# Altium schematic sheet [01] - PWR.SchDoc
size A
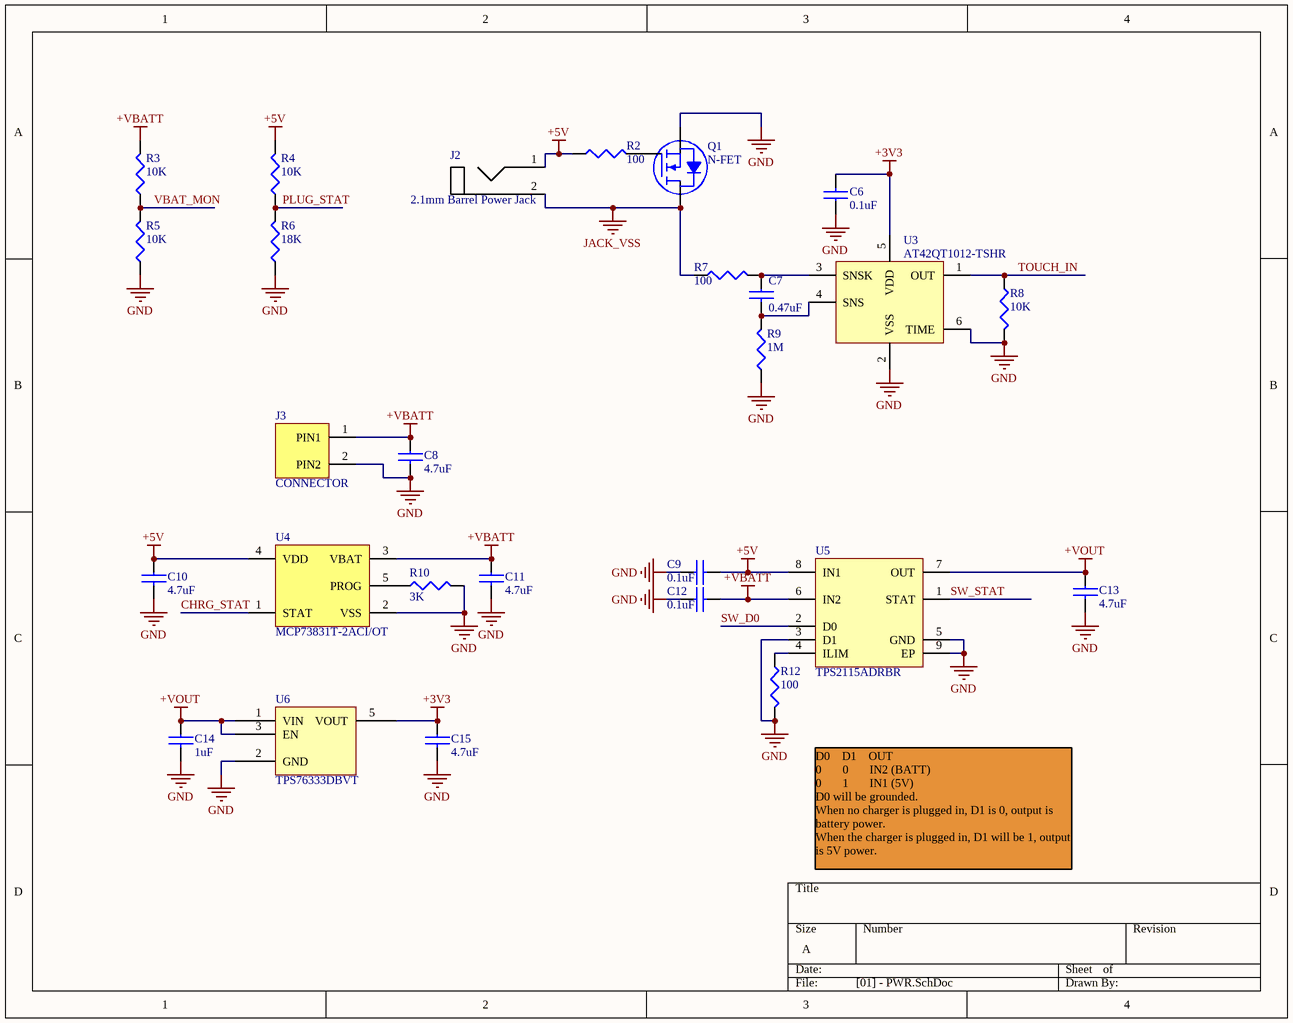
[diagram p0: [01] - PWR.SchDoc]

## Parts
C6  0.1uF  [C0402]
C7  0.47uF  [C0402]
C8  4.7uF  [C0603]
C9  0.1uF  [C0402]
C10  4.7uF  [C0603]
C11  4.7uF  [C0603]
C12  0.1uF  [C0402]
C13  4.7uF  [C0603]
C14  1uF  [C0402]
C15  4.7uF  [C0603]
J2  2.1mm Barrel Power Jack  [2.1mm Power Jack]
J3  CONNECTOR  [S2B-PH-K-S]
Q1  N-FET  [SOT-23-3]
R2  100  [R0402]
R3  10K  [R0402]
R4  10K  [R0402]
R5  10K  [R0402]
R6  18K  [R0402]
R7  100  [R0402]
R8  10K  [R0402]
R9  1M  [R0402]
R10  3K  [R0402]
R12  100  [R0402]
U3  AT42QT1012-TSHR  [SOT-23-6]
U4  MCP73831T-2ACI/OT  [SOT-23-5]
U5  TPS2115ADRBR  [VSON-8]
U6  TPS76333DBVT  [SOT-23-5]

## Nets
+3V3: C6.2 C15.1 U3.5(VDD) U6.5(VOUT)
+5V: C9.2 C10.1 J2.1(+) R2.1 R4.2 U4.4(VDD) U5.8(IN1)
+VBATT: C8.1 C11.1 C12.2 J3.1(PIN1) R3.2 U4.3(VBAT) U5.6(IN2)
+VOUT: C13.1 C14.1 U5.7(OUT) U6.1(VIN) U6.3(EN)
GND: C6.1 C8.2 C9.1 C10.2 C11.2 C12.1 C13.2 C14.2 C15.2 J3.2(PIN2) Q1.2(S) R5.1 R6.1 R8.2 R9.1 R10.2 R12.2 U3.2(VSS) U3.6(TIME) U4.2(VSS) U5.3(D1) U5.5(GND) U5.9(EP) U6.2(GND)
JACK_VSS: J2.2(+) Q1.3(D) R7.1
CHRG_STAT: U4.1(STAT)
PLUG_STAT: R4.1 R6.2
SW_D0: U5.2(D0)
SW_STAT: U5.1(STAT)
TOUCH_IN: R8.1 U3.1(OUT)
VBAT_MON: R3.1 R5.2
NetC7_1: C7.1 R7.2 U3.3(SNSK)
NetC7_2: C7.2 R9.2 U3.4(SNS)
NetQ1_1: Q1.1(G) R2.2
NetR10_1: R10.1 U4.5(PROG)
NetR12_1: R12.1 U5.4(ILIM)

## Notes on the sheet
- D0    D1    OUT
  0       0       IN2 (BATT)
  0       1       IN1 (5V)
  D0 will be grounded.
  When no charger is plugged in, D1 is 0, output is battery power.
  When the charger is plugged in, D1 will be 1, output is 5V power.

## Library data of the parts
C6 C9 C12 = CL05B104KO5NNNC: Cap Ceramic 0.1uF 16V X7R 10% SMD 0402 125C C/T; Manufacturer 1: Samsung; Description 1: Cap Ceramic 0.1uF 16V X7R 10% SMD 0402 125C Paper T/R; Capacitance: 100nF; Supplier 1: Digi-Key; Supplier Part Number 1: 1276-1001-6-ND; Manufacturer Part Number 1: CL05B104KO5NNNC; Stock 1: 9531; Pricing 1: 1=0.1, 10=0.018, 100=0.0081, 500=0.0058, 1000=0.0045, 2500=0.0041, 5000=0.0038 (USD); Mount: Surface Mount; Case/Package: 0402; Case Code (Metric): 1005; Case Code (Imperial): 0402; Material: Ceramic; Contact Plating: Tin; Min Operating Temperature: -55°C; Max Operating Temperature: 125°C; Tolerance: 10%; Package Quantity: 1; Packaging: Tape and Reel; Voltage Rating: 16V; Dielectric: X7R; Voltage: 16V; Voltage Rating (DC): 16V; Length: 1mm; Height: 0.5mm; Width: 0.02inch; Thickness: 0.022inch; Depth: 0.5mm; Radiation Hardening: No; Lead Free: Lead Free; ComponentLink1URL: https://datasheet.ciiva.com/16208/cl05b104kq5nnnc-16208343.pdf; ComponentLink1Description: https://datasheet.ciiva.com/16208/cl05b104kq5nnnc-16208343.pdf; ComponentLink2URL: https://datasheet.ciiva.com/26920/getdatasheetpartid-359683-26920169.pdf; ComponentLink2Description: https://datasheet.ciiva.com/26920/getdatasheetpartid-359683-26920169.pdf; ComponentLink3URL: https://datasheet.ciiva.com/26309/mlcc-catalogdownload2013-eng-26309003.pdf; ComponentLink3Description: https://datasheet.ciiva.com/26309/mlcc-catalogdownload2013-eng-26309003.pdf; ComponentLink4URL: https://datasheet.ciiva.com/29198/458718-da-01-en-vs-kondensator-0402-29198423.pdf; ComponentLink4Description: https://datasheet.ciiva.com/29198/458718-da-01-en-vs-kondensator-0402-29198423.pdf
C7 = CL05A474KP5NNNC: Cap Ceramic 0.47uF 10V X5R 10% SMD 0402 85C T/R; Manufacturer: Samsung; Capacitance: 470nF; Supplier 1: Digi-Key; Supplier Part Number 1: 1276-1173-1-ND; Manufacturer Part Number: CL05A474KP5NNNC; RoHS: Yes; Category: Ceramic Capacitors; Stock 1: 1647717; Pricing 1: 1=0.10000, 10=0.06000, 50=0.03260, 100=0.02670, 500=0.01906, 1000=0.01497, 2500=0.01361, 5000=0.01252 (USD); Mount: Surface Mount; Case/Package: 0402; Case Code (Metric): 1005; Case Code (Imperial): 0402; Min Operating Temperature: -55°C; Max Operating Temperature: 85°C; Tolerance: 10%; Dielectric: X5R; Packaging: Tape and Reel; Voltage Rating: 10V; Voltage Rating (DC): 10V; Series: CL; Construction: Flat; Length: 1mm; Width: 0.02inch; Height: 0.5mm; Thickness: 0.022inch; Depth: 0.5mm; Radiation Hardening: No; Lead Free: Lead Free; RoHS Compliant: Yes; ComponentLink1URL: https://datasheet.ciiva.com/25710/cl05a474kp5nnnc-25710324.pdf?src-supplier=Digi-Key; ComponentLink1Description: https://datasheet.ciiva.com/25710/cl05a474kp5nnnc-25710324.pdf?src-supplier=Digi-Key; ComponentLink2URL: https://datasheet.ciiva.com/26838/getdatasheetpartid-355286-26838191.pdf?src-supplier=Verical; ComponentLink2Description: https://datasheet.ciiva.com/26838/getdatasheetpartid-355286-26838191.pdf?src-supplier=Verical; ComponentLink3URL: https://datasheet.ciiva.com/16437/cl05b104kq5nnnc-16437351.pdf?src-supplier=Future+Electronics; ComponentLink3Description: https://datasheet.ciiva.com/16437/cl05b104kq5nnnc-16437351.pdf?src-supplier=Future+Electronics
C8 C10 C11 C13 C15 = CC0603KRX5R6BB475: 4.7µF ±10% 10V X5R Ceramic Capacitor -55°C ~ 85°C Surface Mount, MLCC 0603 (1608 Metric) 0.063" L x 0.031" W (1.60mm x 0.80mm); Manufacturer 1: Yageo; Supplier 1: Digi-Key; Supplier Part Number 1: 311-1455-6-ND; Manufacturer Part Number 1: CC0603KRX5R6BB475; Description 1: 4.7µF ±10% 10V X5R Ceramic Capacitor -55°C ~ 85°C Surface Mount, MLCC 0603 (1608 Metric) 0.063" L x 0.031" W (1.60mm x 0.80mm); Stock 1: 166715; Pricing 1: 1=0.16, 10=0.115, 100=0.0543, 500=0.0381, 1000=0.0315 (USD); Mount: Surface Mount; Case/Package: 0603; Case Code (Imperial): 0603; Case Code (Metric): 1608; Min Operating Temperature: -55°C; Max Operating Temperature: 85°C; Capacitance: 4.7uF; Voltage Rating: 10V; Voltage Rating (DC): 10V; Tolerance: 10%; Packaging: Tape and Reel; Package Quantity: 1; Dielectric: X5R; Termination: SMD/SMT; Composition: Ceramic; Length: 1.6mm; Height: 0.8mm; Width: 0.8mm; Thickness: 0.035inch; Depth: 0.8mm; Radiation Hardening: No; REACH SVHC: Unknown; Lead Free: Lead Free; Halogen Free: Halogen Free; ComponentLink1URL: https://datasheet.ciiva.com/8033/1525783-8033798.pdf; ComponentLink1Description: https://datasheet.ciiva.com/8033/1525783-8033798.pdf; ComponentLink2URL: https://datasheet.ciiva.com/179/mlccorderingcode-179704.pdf; ComponentLink2Description: https://datasheet.ciiva.com/179/mlccorderingcode-179704.pdf; ComponentLink3URL: https://datasheet.ciiva.com/179/mlccorderingcode-179705.pdf; ComponentLink3Description: https://datasheet.ciiva.com/179/mlccorderingcode-179705.pdf; ComponentLink4URL: https://datasheet.ciiva.com/179/mlccorderingcode-179706.pdf; ComponentLink4Description: https://datasheet.ciiva.com/179/mlccorderingcode-179706.pdf; ComponentLink5URL: https://datasheet.ciiva.com/8033/1525783-8033802.pdf; ComponentLink5Description: https://datasheet.ciiva.com/8033/1525783-8033802.pdf; ComponentLink6URL: https://datasheet.ciiva.com/11586/upy-gphc-x5r-4v-to-50v-12-11586314.pdf; ComponentLink6Description: https://datasheet.ciiva.com/11586/upy-gphc-x5r-4v-to-50v-12-11586314.pdf; ComponentLink7URL: https://datasheet.ciiva.com/16623/upy-gphc-x5r-4v-to-50v-12-16623983.pdf; ComponentLink7Description: https://datasheet.ciiva.com/16623/upy-gphc-x5r-4v-to-50v-12-16623983.pdf
C14 = CL05A105MP5NNNC: Cap Ceramic 1uF 10V X5R 20% SMD 0402 85C C/T; Manufacturer 1: Samsung; Description 1: Cap Ceramic 1uF 10V X5R 20% SMD 0402 85C Paper T/R; Supplier 1: Digi-Key; Supplier Part Number 1: 1276-1448-6-ND; Manufacturer Part Number 1: CL05A105MP5NNNC; Stock 1: 42775; Pricing 1: 1=0.1, 10=0.028, 100=0.0124, 500=0.0089, 1000=0.007, 2500=0.0063, 5000=0.0058 (USD); Mount: Surface Mount; Case/Package: 0402; Case Code (Metric): 1005; Case Code (Imperial): 0402; Min Operating Temperature: -55°C; Max Operating Temperature: 85°C; Package Quantity: 1; Packaging: Tape and Reel; Capacitance: 1uF; Tolerance: 20%; Voltage Rating: 10V; Dielectric: X5R; Voltage Rating (DC): 10V; Length: 1mm; Height: 0.5mm; Width: 0.02inch; Thickness: 0.022inch; Depth: 0.5mm; Radiation Hardening: No; Lead Free: Lead Free; ComponentLink1URL: https://datasheet.ciiva.com/25802/cl05a105mp5nnnc-25802049.pdf; ComponentLink1Description: https://datasheet.ciiva.com/25802/cl05a105mp5nnnc-25802049.pdf
J2 = 2.1mm Barrel Power Jack: 2.1mm Barrel Power Jack Panel Mount
J3 = S2B-PH-K-S(LF)(SN): CONN HEADER R/A 2POS 2MM; Manufacturer 1: JST; Current Rating: 2A; Contact Resistance: 20mR; Voltage Rating: 100V; Number of Positions: 2; Gender: Male; Connector Type: Male Pin; Insulation Resistance: 1GR; Supplier 1: Digi-Key; Supplier Part Number 1: 455-1719-ND; Manufacturer Part Number 1: S2B-PH-K-S(LF)(SN); Stock 1: 161668; Pricing 1: 1=0.17, 10=0.161, 100=0.0991, 500=0.08202, 1000=0.07177, 5000=0.06152, 10000=0.05981 (USD); Mount: Through Hole; Number of Pins: 2; Contact Material: Tin,Brass,Bronze; Contact Plating: Tin,Copper; Color: Natural,White; Housing Color: White; Housing Material: Polyamide; Min Operating Temperature: -25°C; Max Operating Temperature: 85°C; Max Current Rating: 2A; Number of Rows: 1; Packaging: Bulk; Termination: Solder; Fastening Type: Detent; Number of Contacts: 2; Max Voltage Rating (AC): 100V; Orientation: Right Angle; Number of Poles: 2; Voltage Rating (AC): 100V; Max Voltage Rating (DC): 100V; Working Voltage: 100V; Length: 5.9mm; Height: 9.4mm; Pitch: 2mm; Width: 4.5mm; Contact Mating Length: 0.13inch; Depth: 7.6mm; Lead Pitch: 2mm; REACH SVHC: No SVHC; Lead Free: Lead Free; Flammability Rating: UL94 V-0; ComponentLink1URL: http://www1.futureelectronics.com/doc/JST/S2B-PH-K-S(LF)(SN).pdf?src-supplier=Future+Electronics; ComponentLink1Description: http://www1.futureelectronics.com/doc/JST/S2B-PH-K-S(LF)(SN).pdf?src-supplier=Future+Electronics; ComponentLink2URL: https://www.verical.com/server-webapp/html/getDatasheet?partID=641020&src-supplier=Verical; ComponentLink2Description: https://www.verical.com/server-webapp/html/getDatasheet?partID=641020&src-supplier=Verical; ComponentLink3URL: http://www.jst-mfg.com/product/pdf/eng/ePH.pdf?src-supplier=Digi-Key; ComponentLink3Description: http://www.jst-mfg.com/product/pdf/eng/ePH.pdf?src-supplier=Digi-Key; ComponentLink4URL: http://www.farnell.com/datasheets/80564.pdf?src-supplier=Element14; ComponentLink4Description: http://www.farnell.com/datasheets/80564.pdf?src-supplier=Element14
Q1 = NDS331N: MOSFET N-CH 20V 1.3A SSOT3; Manufacturer 1: ON Semiconductor / Fairchild; Nominal Vgs: 700mV; Rds On Max: 160mR; Input Capacitance: 162pF; Rise Time: 25ns; Max Power Dissipation: 500mW; Number of Elements: 1; Gate to Source Voltage (Vgs): 8V; Fall Time: 5ns; Drain to Source Resistance: 210mR; Turn-Off Delay Time: 10ns; Element Configuration: Single; Supplier 1: Digi-Key; Supplier Part Number 1: NDS331NCT-ND; Manufacturer Part Number 1: NDS331N; Stock 1: 114658; Pricing 1: 1=0.44, 10=0.349, 100=0.2395, 500=0.16424, 1000=0.12318 (USD); Mount: Surface Mount; Case/Package: TO-236-3; Number of Pins: 3; Weight: 0.03g; Min Operating Temperature: -55°C; Max Operating Temperature: 150°C; Package Quantity: 1; Packaging: Tape and Reel; Drain to Source Voltage (Vdss): 20V; Continuous Drain Current (ID): 1.3A; Drain to Source Breakdown Voltage: 20V; Power Dissipation: 500mW; Threshold Voltage: 700mV; Turn-On Delay Time: 5ns; Voltage Rating (DC): 20V; Current Rating: 1.3A; On-State Resistance: 160mR; Length: 2.92mm; Height: 0.94mm; Width: 1.4mm; Radiation Hardening: No; REACH SVHC: No SVHC; Lead Free: Lead Free; ComponentLink1URL: http://www.farnell.com/datasheets/2303897.pdf?src-supplier=Newark; ComponentLink1Description: http://www.farnell.com/datasheets/2303897.pdf?src-supplier=Newark; ComponentLink2URL: http://www.farnell.com/datasheets/195775.pdf?src-supplier=Element14; ComponentLink2Description: http://www.farnell.com/datasheets/195775.pdf?src-supplier=Element14; ComponentLink3URL: https://www.verical.com/server-webapp/html/getDatasheet?partID=110520&src-supplier=Verical; ComponentLink3Description: https://www.verical.com/server-webapp/html/getDatasheet?partID=110520&src-supplier=Verical; ComponentLink4URL: http://www.jameco.com/Jameco/Products/ProdDS/1030703.pdf?src-supplier=Jameco; ComponentLink4Description: http://www.jameco.com/Jameco/Products/ProdDS/1030703.pdf?src-supplier=Jameco; ComponentLink5URL: http://www.mouser.com/ds/2/149/NDS331N-116501.pdf?src-supplier=Mouser; ComponentLink5Description: http://www.mouser.com/ds/2/149/NDS331N-116501.pdf?src-supplier=Mouser; ComponentLink6URL: https://www.fairchildsemi.com/datasheets/ND/NDS331N.pdf?src-supplier=Avnet; ComponentLink6Description: https://www.fairchildsemi.com/datasheets/ND/NDS331N.pdf?src-supplier=Avnet; ComponentLink7URL: http://www.fairchildsemi.com/ds/ND/NDS331N.pdf?src-supplier=Avnet+Europe; ComponentLink7Description: http://www.fairchildsemi.com/ds/ND/NDS331N.pdf?src-supplier=Avnet+Europe
R2 R7 R12 = ERJ-2GEJ101X: Res Thick Film 0402 100 Ohm 5% 0.1W(1/10W) ±200ppm/C Molded SMD Automotive T/R; Manufacturer 1: Panasonic ECG; Resistance: 100R; Temperature Coefficient: 200ppm/°C; Power Rating: 100mW; Voltage Rating: 50V; Supplier 1: Digi-Key; Supplier Part Number 1: P100JDKR-ND; Manufacturer Part Number 1: ERJ-2GEJ101X; Description 1: Res Thick Film 0402 100 Ohm 5% 0.1W(1/10W) ±200ppm/C Molded SMD Automotive T/R; Stock 1: 1981514; Pricing 1: 1=0.1, 10=0.029, 100=0.0117, 1000=0.0053, 2500=0.0046, 5000=0.0038 (USD); Mount: Surface Mount; Case/Package: 0402; Contact Plating: Tin; Case Code (Imperial): 0402; Case Code (Metric): 1005; Min Operating Temperature: -55°C; Max Operating Temperature: 155°C; Tolerance: 5%; Composition: Thick Film; Packaging: Cut Tape; Package Quantity: 1; Termination: SMD/SMT; Number of Terminations: 2; Military Standard: Not; Max Power Dissipation: 100mW; Voltage Rating (DC): 50V; Length: 1mm; Height: 0.35mm; Depth: 0.5mm; Width: 0.5mm; Radiation Hardening: No; REACH SVHC: No SVHC; Lead Free: Lead Free; ComponentLink1URL: https://datasheet.ciiva.com/11821/0900766b80f806dd-11821172.pdf; ComponentLink1Description: https://datasheet.ciiva.com/11821/0900766b80f806dd-11821172.pdf; ComponentLink2URL: https://datasheet.ciiva.com/16767/70260739-16767557.pdf; ComponentLink2Description: https://datasheet.ciiva.com/16767/70260739-16767557.pdf; ComponentLink3URL: https://datasheet.ciiva.com/48531/aoa0000ce1-48531079.pdf; ComponentLink3Description: https://datasheet.ciiva.com/48531/aoa0000ce1-48531079.pdf; ComponentLink4URL: https://datasheet.ciiva.com/16511/aoa0000ce1-16511417.pdf; ComponentLink4Description: https://datasheet.ciiva.com/16511/aoa0000ce1-16511417.pdf; ComponentLink5URL: https://datasheet.ciiva.com/16777/70260739-16777609.pdf; ComponentLink5Description: https://datasheet.ciiva.com/16777/70260739-16777609.pdf; ComponentLink6URL: https://datasheet.ciiva.com/9186/aoa0000ce1-9186682.pdf; ComponentLink6Description: https://datasheet.ciiva.com/9186/aoa0000ce1-9186682.pdf; ComponentLink7URL: https://datasheet.ciiva.com/17207/aoa0000ce1-17207978.pdf; ComponentLink7Description: https://datasheet.ciiva.com/17207/aoa0000ce1-17207978.pdf; ComponentLink8URL: https://datasheet.ciiva.com/30133/4aoa0000ce1-30133884.pdf; ComponentLink8Description: https://datasheet.ciiva.com/30133/4aoa0000ce1-30133884.pdf; ComponentLink9URL: https://datasheet.ciiva.com/46389/1500035-46389644.pdf; ComponentLink9Description: https://datasheet.ciiva.com/46389/1500035-46389644.pdf; ComponentLink10URL: https://datasheet.ciiva.com/43460/1500035-43460365.pdf; ComponentLink10Description: https://datasheet.ciiva.com/43460/1500035-43460365.pdf
R3-R5 R8 = ERJ-2GEJ103X: Res Thick Film 0402 10K Ohm 5% 0.1W(1/10W) ±200ppm/C Molded SMD Automotive Punched T/R; Manufacturer 1: Panasonic ECG; Resistance: 10kR; Temperature Coefficient: 200ppm/°C; Power Rating: 100mW; Voltage Rating: 50V; Supplier 1: Digi-Key; Supplier Part Number 1: P10KJDKR-ND; Manufacturer Part Number 1: ERJ-2GEJ103X; Description 1: Res Thick Film 0402 10K Ohm 5% 0.1W(1/10W) ±200ppm/C Molded SMD Automotive Punched T/R; Stock 1: 1210425; Pricing 1: 1=0.1, 10=0.029, 100=0.0117, 1000=0.0053, 2500=0.0046, 5000=0.0038 (USD); Mount: Surface Mount; Case/Package: 0402; Contact Plating: Tin; Case Code (Metric): 1005; Case Code (Imperial): 0402; Min Operating Temperature: -55°C; Max Operating Temperature: 155°C; Tolerance: 5%; Packaging: Cut Tape; Composition: Thick Film; Package Quantity: 1; Number of Terminations: 2; Termination: SMD/SMT; Military Standard: Not; Max Power Dissipation: 100mW; Voltage Rating (DC): 50V; Length: 1mm; Height: 0.35mm; Depth: 0.5mm; Width: 0.02inch; Radiation Hardening: No; REACH SVHC: No SVHC; Lead Free: Lead Free; ComponentLink1URL: https://datasheet.ciiva.com/11821/0900766b80f806dd-11821170.pdf; ComponentLink1Description: https://datasheet.ciiva.com/11821/0900766b80f806dd-11821170.pdf; ComponentLink2URL: https://datasheet.ciiva.com/17212/aoa0000ce1-17212101.pdf; ComponentLink2Description: https://datasheet.ciiva.com/17212/aoa0000ce1-17212101.pdf; ComponentLink3URL: https://datasheet.ciiva.com/46371/1678796-46371910.pdf; ComponentLink3Description: https://datasheet.ciiva.com/46371/1678796-46371910.pdf; ComponentLink4URL: https://datasheet.ciiva.com/24070/aoa0000ce1-37422-24070679.pdf; ComponentLink4Description: https://datasheet.ciiva.com/24070/aoa0000ce1-37422-24070679.pdf; ComponentLink5URL: https://datasheet.ciiva.com/43460/1678796-43460391.pdf; ComponentLink5Description: https://datasheet.ciiva.com/43460/1678796-43460391.pdf; ComponentLink6URL: https://datasheet.ciiva.com/16774/70260739-16774504.pdf; ComponentLink6Description: https://datasheet.ciiva.com/16774/70260739-16774504.pdf; ComponentLink7URL: https://datasheet.ciiva.com/27055/1935721-27055112.pdf; ComponentLink7Description: https://datasheet.ciiva.com/27055/1935721-27055112.pdf; ComponentLink8URL: https://datasheet.ciiva.com/16767/70260739-16767130.pdf; ComponentLink8Description: https://datasheet.ciiva.com/16767/70260739-16767130.pdf; ComponentLink9URL: https://datasheet.ciiva.com/28514/1678796-28514154.pdf; ComponentLink9Description: https://datasheet.ciiva.com/28514/1678796-28514154.pdf; ComponentLink10URL: https://datasheet.ciiva.com/48531/aoa0000ce1-48531082.pdf; ComponentLink10Description: https://datasheet.ciiva.com/48531/aoa0000ce1-48531082.pdf; ComponentLink11URL: https://datasheet.ciiva.com/9194/aoa0000ce1-9194140.pdf; ComponentLink11Description: https://datasheet.ciiva.com/9194/aoa0000ce1-9194140.pdf; ComponentLink12URL: https://datasheet.ciiva.com/22785/1678796-22785949.pdf; ComponentLink12Description: https://datasheet.ciiva.com/22785/1678796-22785949.pdf
R6 = RC0402FR-0718KL: RES SMD 18K OHM 1% 1/16W 0402; Manufacturer: Yageo; Resistance: 18kR; Power Rating: 63mW; Voltage Rating: 50V; Temperature Coefficient: 100ppm/°C; Supplier 1: Digi-Key; Supplier Part Number 1: 311-18.0KLRCT-ND; Manufacturer Part Number: RC0402FR-0718KL; RoHS: Yes; Category: Chip SMD Resistors; Stock 1: 341841; Pricing 1: 1=0.10000, 10=0.01400, 100=0.00580, 1000=0.00260, 2500=0.00226, 5000=0.00186 (USD); Case/Package: 0402; Case Code (Metric): 1005; Case Code (Imperial): 0402; Size Code: 0402; Min Operating Temperature: -55°C; Max Operating Temperature: 155°C; Tolerance: 1%; Packaging: Tape and Reel; Package Quantity: 1; Resistor Type: Thick Film; Number of Terminations: 2; Termination: SMD/SMT; Max Power Dissipation: 63mW; Features: Moisture Resistant; Series: RC; Construction: Rectangular; Technology: THICK FILM; Resistance Tolerance: 1%; Length: 1mm; Width: 0.02inch; Height: 0.016inch; Depth: 0.5mm; REACH SVHC: Unknown; Military Standard: Not; Lead Free: Lead Free; RoHS Compliant: Yes; ComponentLink1URL: https://datasheet.ciiva.com/11808/0900766b80c66297-11808760.pdf?src-supplier=RSComponents; ComponentLink1Description: https://datasheet.ciiva.com/11808/0900766b80c66297-11808760.pdf?src-supplier=RSComponents; ComponentLink2URL: https://datasheet.ciiva.com/2453/pyu-r-int-thick-7-2453604.pdf?src-supplier=Digi-Key; ComponentLink2Description: https://datasheet.ciiva.com/2453/pyu-r-int-thick-7-2453604.pdf?src-supplier=Digi-Key; ComponentLink3URL: https://datasheet.ciiva.com/2453/pyu-r-int-thick-7-2453605.pdf?src-supplier=Digi-Key; ComponentLink3Description: https://datasheet.ciiva.com/2453/pyu-r-int-thick-7-2453605.pdf?src-supplier=Digi-Key; ComponentLink4URL: https://datasheet.ciiva.com/2453/pyu-r-int-thick-7-2453606.pdf?src-supplier=Digi-Key; ComponentLink4Description: https://datasheet.ciiva.com/2453/pyu-r-int-thick-7-2453606.pdf?src-supplier=Digi-Key; ComponentLink5URL: https://datasheet.ciiva.com/16741/pyu-rc0402-51-rohs-l-6-r-16741882.pdf?src-supplier=Future+Electronics; ComponentLink5Description: https://datasheet.ciiva.com/16741/pyu-rc0402-51-rohs-l-6-r-16741882.pdf?src-supplier=Future+Electronics; ComponentLink6URL: https://datasheet.ciiva.com/5558/pyu-rc0402-51-rohs-l-6-r-8721-5558222.pdf?src-supplier=Mouser; ComponentLink6Description: https://datasheet.ciiva.com/5558/pyu-rc0402-51-rohs-l-6-r-8721-5558222.pdf?src-supplier=Mouser; ComponentLink7URL: https://datasheet.ciiva.com/7849/1018594-7849855.pdf?src-supplier=Element14; ComponentLink7Description: https://datasheet.ciiva.com/7849/1018594-7849855.pdf?src-supplier=Element14
R9 = RC0402JR-071ML: Manufacturer 1: Yageo; Resistance: 1MR; Power Rating: 62.5mW; Tolerance: 5%; Voltage Rating: 50V; Temperature Coefficient: 100ppm/°C; Max Power Dissipation: 63mW; Supplier 1: Digi-Key; Supplier Part Number 1: 311-1.0MJRCT-ND; Manufacturer Part Number 1: RC0402JR-071ML; Stock 1: 2904136; Pricing 1: 1=0.1, 10=0.013, 100=0.0055, 1000=0.00245, 2500=0.00212, 5000=0.00176 (USD); Case/Package: 0402; Weight: 2.3E-05oz; Case Code (Metric): 1005; Case Code (Imperial): 0402; Min Operating Temperature: -55°C; Max Operating Temperature: 155°C; Composition: Thick Film; Package Quantity: 1; Packaging: Tape and Reel; Number of Terminations: 2; Termination: SMD/SMT; Military Standard: Not; Features: Moisture Resistant; Length: 1mm; Height: 0.016inch; Width: 0.02inch; Depth: 0.5mm; REACH SVHC: No SVHC; Lead Free: Lead Free; ComponentLink1URL: http://www.yageo.com/documents/recent/PYu-RC_Group_51_RoHS_L_10.pdf?src-supplier=Digi-Key; ComponentLink1Description: http://www.yageo.com/documents/recent/PYu-RC_Group_51_RoHS_L_10.pdf?src-supplier=Digi-Key; ComponentLink2URL: http://www.farnell.com/datasheets/1018594.pdf?src-supplier=Element14; ComponentLink2Description: http://www.farnell.com/datasheets/1018594.pdf?src-supplier=Element14; ComponentLink3URL: http://www.yageo.com/documents/recent/PYu-RC_Group_51_RoHS_L_9.pdf?src-supplier=Mouser; ComponentLink3Description: http://www.yageo.com/documents/recent/PYu-RC_Group_51_RoHS_L_9.pdf?src-supplier=Mouser; ComponentLink4URL: http://www.yageo.com/documents/recent/PYu-RC0402_51_RoHS_L_6_r.pdf?src-supplier=Future+Electronics; ComponentLink4Description: http://www.yageo.com/documents/recent/PYu-RC0402_51_RoHS_L_6_r.pdf?src-supplier=Future+Electronics
R10 = ERJ-2RKF3001X: RES SMD 3K OHM 1% 1/10W 0402; Manufacturer: Panasonic; Power Rating: 100mW; Voltage Rating: 50V; Resistance: 3kR; Temperature Coefficient: 100ppm/°C; Supplier 1: Digi-Key; Supplier Part Number 1: P3.00KLCT-ND; Manufacturer Part Number: ERJ-2RKF3001X; Stock 1: 567304; Pricing 1: 1=0.1, 10=0.045, 100=0.0183, 1000=0.00823, 2500=0.00715, 5000=0.0059 (USD); Mount: Surface Mount; Case/Package: 0402; Case Code (Metric): 1005; Case Code (Imperial): 0402; Contact Plating: Tin; Min Operating Temperature: -55°C; Max Operating Temperature: 155°C; Tolerance: 1%; Packaging: Tape and Reel; Package Quantity: 1; Composition: Thick Film; Number of Terminations: 2; Termination: SMD/SMT; Military Standard: Not; Max Power Dissipation: 100mW; Voltage Rating (DC): 50V; Features: Automotive AEC-Q200; Length: 1mm; Height: 0.35mm; Width: 0.02inch; Depth: 0.5mm; Radiation Hardening: No; REACH SVHC: No SVHC; Lead Free: Lead Free; ComponentLink1URL: http://industrial.panasonic.com/www-data/pdf/AOA0000/AOA0000CE2.pdf?src-supplier=Avnet; ComponentLink1Description: http://industrial.panasonic.com/www-data/pdf/AOA0000/AOA0000CE2.pdf?src-supplier=Avnet; ComponentLink2URL: http://www.farnell.com/datasheets/1694929.pdf?src-supplier=Element14; ComponentLink2Description: http://www.farnell.com/datasheets/1694929.pdf?src-supplier=Element14; ComponentLink3URL: http://www.mouser.com/ds/2/315/AOA0000C283-1093288.pdf?src-supplier=Mouser; ComponentLink3Description: http://www.mouser.com/ds/2/315/AOA0000C283-1093288.pdf?src-supplier=Mouser; ComponentLink4URL: http://www.farnell.com/datasheets/1911175.pdf?src-supplier=Farnell; ComponentLink4Description: http://www.farnell.com/datasheets/1911175.pdf?src-supplier=Farnell; ComponentLink5URL: http://www.farnell.com/datasheets/1678782.pdf?src-supplier=Element14; ComponentLink5Description: http://www.farnell.com/datasheets/1678782.pdf?src-supplier=Element14
U3 = AT42QT1012-TSHR: ATMEL         AT42QT1012-TSHR             Capacitive Touch Sensor, One-Channel, 1.8 V, 5.5 V, SOT-23, 6 Pins, -40 C; Manufacturer: Microchip / Atmel; Resolution: 14b; Operating Supply Current: 59uA; Interface: Serial; Number of Inputs: 1; Nominal Supply Current: 124uA; Min Supply Voltage: 1.8V; Max Supply Voltage: 5.5V; Load Capacitance: 20pF; Supplier 1: Digi-Key; Supplier Part Number 1: AT42QT1012-TSHRCT-ND; Manufacturer Part Number: AT42QT1012-TSHR; Stock 1: 16177; Pricing 1: 1=0.6, 25=0.546, 100=0.4944 (USD); Mount: Surface Mount; Case/Package: SOT-23-6; Number of Pins: 6; Contact Plating: Gold; Min Operating Temperature: -40°C; Max Operating Temperature: 85°C; Packaging: Tape and Reel; Package Quantity: 4500; Number of Channels: 1; Touchscreen: Capacitive; Sensing Method: Capacitive; Length: 3mm; Height: 1.3mm; Width: 1.75mm; REACH SVHC: No SVHC; Lead Free: Lead Free; ComponentLink1URL: http://www.farnell.com/datasheets/1738894.pdf?src-supplier=Element14; ComponentLink1Description: http://www.farnell.com/datasheets/1738894.pdf?src-supplier=Element14; ComponentLink2URL: https://media.digikey.com/pdf/Data%20Sheets/Atmel%20PDFs/Application%20Specific%20Qtouch%20Solutions.pdf?src-supplier=Digi-Key; ComponentLink2Description: https://media.digikey.com/pdf/Data%20Sheets/Atmel%20PDFs/Application%20Specific%20Qtouch%20Solutions.pdf?src-supplier=Digi-Key; ComponentLink3URL: https://www.verical.com/server-webapp/html/getDatasheet?partID=503663&src-supplier=Verical; ComponentLink3Description: https://www.verical.com/server-webapp/html/getDatasheet?partID=503663&src-supplier=Verical
U4 = MCP73831T-2ACI/OT: Manufacturer 1: Microchip; Number of Cells: 1; Output Voltage: 4.2V; Max Supply Voltage: 6V; Min Supply Voltage: 3.75V; Output Current: 500mA; Max Output Voltage: 4.5V; Min Output Voltage: 4.168V; Max Power Dissipation: 1.54W; Drain to Source Resistance: 350mR; Voltage Rating: 4.534V; Supplier 1: Digi-Key; Supplier Part Number 1: MCP73831T-2ACI/OTCT-ND; Manufacturer Part Number 1: MCP73831T-2ACI/OT; Stock 1: 48482; Pricing 1: 1=0.58, 25=0.484, 100=0.4326 (USD); Mount: Surface Mount; Case/Package: SOT-23; Number of Pins: 5; Weight: 0.00709oz; Contact Plating: Tin,Matte; Min Operating Temperature: -40°C; Max Operating Temperature: 85°C; Packaging: Tape and Reel; Max Charge Current: 500mA; Max Input Voltage: 6V; Number of Outputs: 1; Number of Channels: 1; Termination: SMD/SMT; Length: 0.122inch; Height: 0.051inch; Width: 0.071inch; Radiation Hardening: No; REACH SVHC: No SVHC; Lead Free: Lead Free; ComponentLink1URL: http://www.microchip.com/mymicrochip/filehandler.aspx?ddocname=en023833&src-supplier=Digi-Key; ComponentLink1Description: http://www.microchip.com/mymicrochip/filehandler.aspx?ddocname=en023833&src-supplier=Digi-Key; ComponentLink2URL: http://www.farnell.com/datasheets/630369.pdf?src-supplier=Element14; ComponentLink2Description: http://www.farnell.com/datasheets/630369.pdf?src-supplier=Element14; ComponentLink3URL: http://www.farnell.com/datasheets/2124927.pdf?src-supplier=Element14; ComponentLink3Description: http://www.farnell.com/datasheets/2124927.pdf?src-supplier=Element14; ComponentLink4URL: http://ww1.microchip.com/downloads/en/DeviceDoc/21984e.pdf?src-supplier=Avnet; ComponentLink4Description: http://ww1.microchip.com/downloads/en/DeviceDoc/21984e.pdf?src-supplier=Avnet; ComponentLink5URL: http://www.farnell.com/datasheets/2124927.pdf?src-supplier=Newark; ComponentLink5Description: http://www.farnell.com/datasheets/2124927.pdf?src-supplier=Newark; ComponentLink6URL: http://www.microchip.com/mymicrochip/filehandler.aspx?ddocname=en025112&src-supplier=Future+Electronics; ComponentLink6Description: http://www.microchip.com/mymicrochip/filehandler.aspx?ddocname=en025112&src-supplier=Future+Electronics; ComponentLink7URL: http://www.produktinfo.conrad.com/datenblaetter/650000-674999/651521-da-01-en-CONTR__MCP73831T_2ACI_OT_SOT_23_5_MCP.pdf?src-supplier=Conrad; ComponentLink7Description: http://www.produktinfo.conrad.com/datenblaetter/650000-674999/651521-da-01-en-CONTR__MCP73831T_2ACI_OT_SOT_23_5_MCP.pdf?src-supplier=Conrad
U5 = TPS2115ADRBR: IC OR CTRLR SRC SELECT 8SON; Manufacturer: Texas Instruments; Number of Inputs: 2; Number of Outputs: 1; Output Current: 1.25A; Max Input Voltage: 5.5V; Min Input Voltage: 2.8V; Turn-On Delay Time: 1ms; Max Power Dissipation: 2.5W; On-State Resistance: 150mR; Turn-Off Delay Time: 5ms; Max Supply Current: 55uA; Supplier 1: Digi-Key; Supplier Part Number 1: 296-23394-1-ND; Manufacturer Part Number: TPS2115ADRBR; Stock 1: 18497; Pricing 1: 1=2.01, 10=1.801, 100=1.448, 500=1.18966, 1000=0.98571 (USD); Case/Package: TSSOP; Number of Pins: 8; Weight: 0.000847oz; Min Operating Temperature: -40°C; Max Operating Temperature: 85°C; Packaging: Tape and Reel; Package Quantity: 3000; Max Output Current: 1.25A; Current - Output 2: 1.25A; Operating Supply Voltage: 5.5V; Operating Supply Current: 55uA; Radiation Hardening: No; Lead Free: Lead Free; REACH SVHC: No SVHC; ComponentLink1URL: https://www.verical.com/server-webapp/html/getDatasheet?partID=221489&src-supplier=Verical; ComponentLink1Description: https://www.verical.com/server-webapp/html/getDatasheet?partID=221489&src-supplier=Verical; ComponentLink2URL: http://www.ti.com/lit/ds/symlink/tps2115a.pdf?src-supplier=Digi-Key; ComponentLink2Description: http://www.ti.com/lit/ds/symlink/tps2115a.pdf?src-supplier=Digi-Key; ComponentLink3URL: http://www.ti.com/general/docs/lit/getliterature.tsp?genericPartNumber=TPS2115A&&fileType=pdf&src-supplier=Avnet; ComponentLink3Description: http://www.ti.com/general/docs/lit/getliterature.tsp?genericPartNumber=TPS2115A&&fileType=pdf&src-supplier=Avnet
U6 = TPS76333DBVT: IC REG LDO 3.3V 0.15A SOT23-5; Manufacturer 1: Texas Instruments; Output Current: 150mA; Max Power Dissipation: 555mW; Max Supply Voltage: 10V; Min Supply Voltage: 2.7V; Input Bias Current: 85uA; Dropout Voltage: 300mV; Number of Outputs: 1; Min Current Limit: 500mA; Polarity: Positive; Quiescent Current: 80uA; Output Voltage Accuracy: 3%; Supplier 1: Digi-Key; Supplier Part Number 1: 296-2705-6-ND; Manufacturer Part Number 1: TPS76333DBVT; Description 1: IC REG LDO 3.3V 0.15A SOT23-5; Stock 1: 3719; Pricing 1: 1=0.96, 10=0.857, 100=0.6681 (USD); Case/Package: SOT-23; Number of Pins: 5; Contact Plating: Gold; Min Operating Temperature: -40°C; Max Operating Temperature: 125°C; Package Quantity: 1; Packaging: Tape and Reel; Power Dissipation: 555mW; Output Voltage: 3.3V; Power Rating: 555mW; Nominal Output Voltage: 3.3V; Max Output Current: 150mA; Max Input Voltage: 10V; Min Input Voltage: 2.7V; Number of Regulators: 1; Min Output Voltage: 3.3V; Max Output Voltage: 3.3V; Termination: SMD/SMT; Voltage: 3.3V; Accuracy: 3%; Current Rating: 150mA; Length: 2.9mm; Height: 1.15mm; Width: 1.6mm; Radiation Hardening: No; REACH SVHC: No SVHC; Lead Free: Lead Free; ComponentLink1URL: https://datasheet.ciiva.com/30507/tps76333dbvt-30507683.pdf; ComponentLink1Description: https://datasheet.ciiva.com/30507/tps76333dbvt-30507683.pdf; ComponentLink2URL: https://datasheet.ciiva.com/25626/0900766b8062816d-25626741.pdf; ComponentLink2Description: https://datasheet.ciiva.com/25626/0900766b8062816d-25626741.pdf; ComponentLink3URL: https://datasheet.ciiva.com/46390/1882045-46390261.pdf; ComponentLink3Description: https://datasheet.ciiva.com/46390/1882045-46390261.pdf; ComponentLink4URL: https://datasheet.ciiva.com/27049/763729-27049869.pdf; ComponentLink4Description: https://datasheet.ciiva.com/27049/763729-27049869.pdf; ComponentLink5URL: https://datasheet.ciiva.com/41462/001015062-da-01-en-ic-reg-ldo-3-3v-0-tps76333dbvt-sot-5-tid-41462909.pdf; ComponentLink5Description: https://datasheet.ciiva.com/41462/001015062-da-01-en-ic-reg-ldo-3-3v-0-tps76333dbvt-sot-5-tid-41462909.pdf; ComponentLink6URL: https://datasheet.ciiva.com/26904/tps76333dbvt-26904174.pdf; ComponentLink6Description: https://datasheet.ciiva.com/26904/tps76333dbvt-26904174.pdf